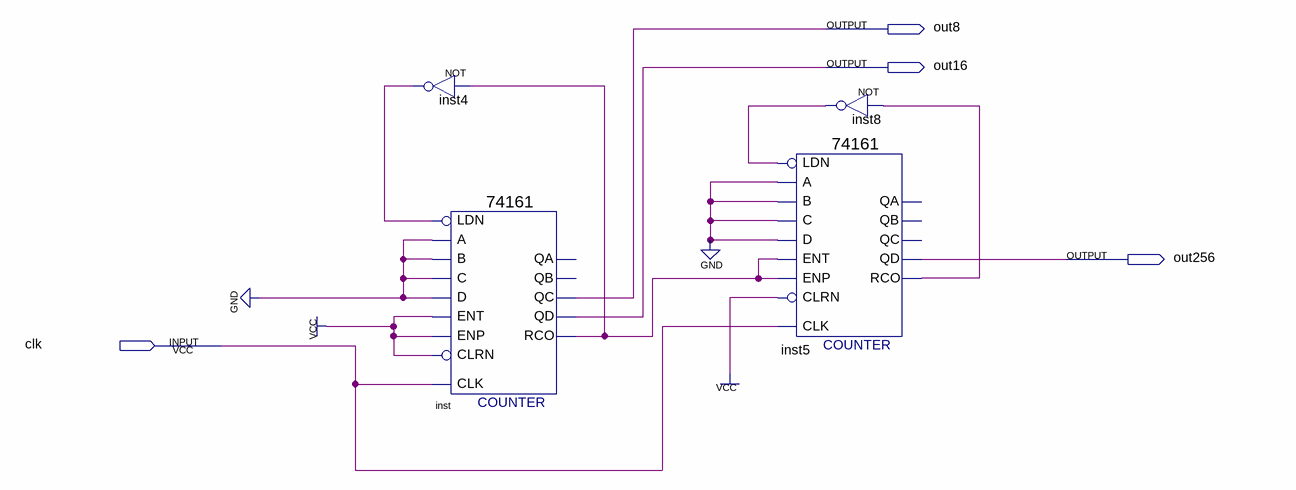
[diagram p0: schematic sheet]
// Quartus schematic fenpin.bdf as structural Verilog: 4 symbols, 4 pins
module fenpin (
  input  clk,
  output out8,
  output out16,
  output out256
);

  wire inst4_out, inst5_rco, inst8_out, inst_rco;

  not inst4 (inst4_out, inst_rco);
  \74161  inst (
    .CLRN(1'b1), .CLK(clk), .ENP(1'b1), .LDN(inst4_out), .A(1'b0), .D(1'b0), .ENT(1'b1), .B(1'b0), .C(1'b0),
    .QD(out16), .QC(out8), .RCO(inst_rco));  // open: QB, QA
  \74161  inst5 (
    .CLRN(1'b1), .CLK(clk), .ENP(inst_rco), .LDN(inst8_out), .A(1'b0), .D(1'b0), .ENT(inst_rco), .B(1'b0),
    .C(1'b0), .QD(out256), .RCO(inst5_rco));  // open: QC, QB, QA
  not inst8 (inst8_out, inst5_rco);
endmodule
